# Altium schematic sheet EMGV1.SchDoc
size A1
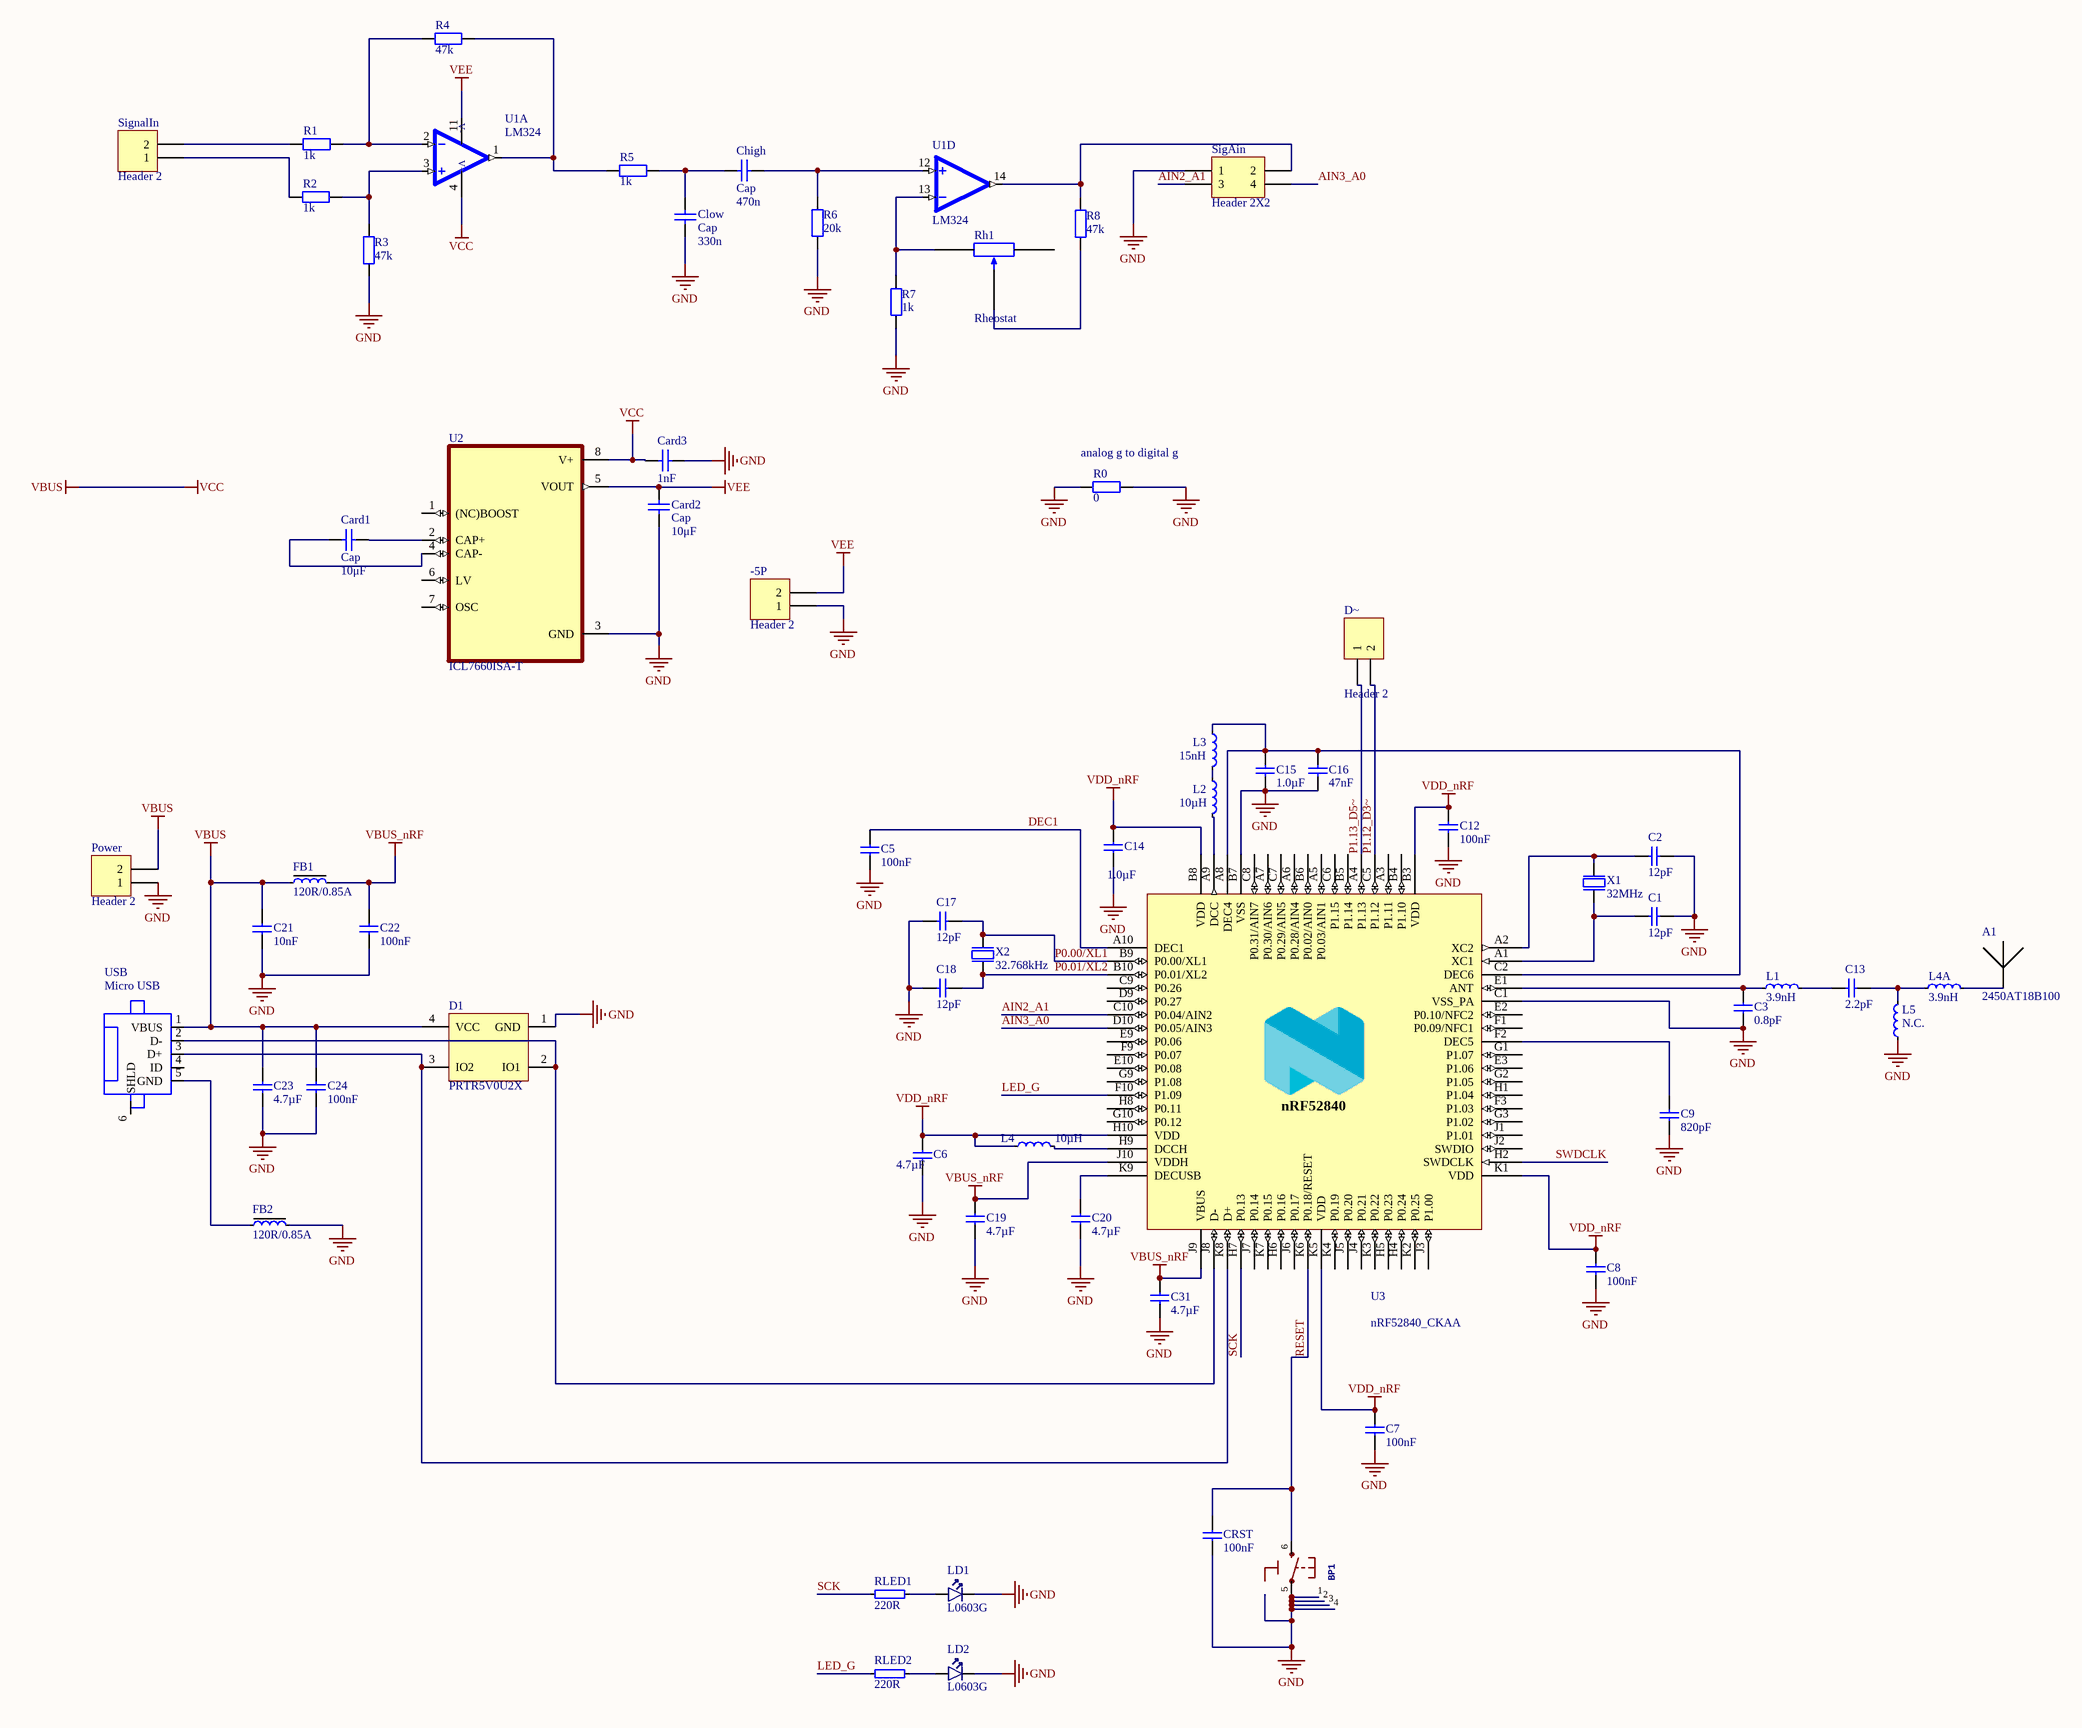
[diagram p0: EMGV1.SchDoc]

## Parts
-5P  Header 2  [HDR1X2]
A1  2450AT18B100  [2450AT18B100]
BP1  PTS820  [C&K_PTS820_NO_HOLES]  (value not drawn)
C1  12pF  [CAPC0603X03L_C]
C2  12pF  [CAPC0603X03L_C]
C3  0.8pF  [CAPC0603X03L_C]
C5  100nF  [CAPC0603X03L_C]
C6  4.7µF  [CAPC1608X06L]
C7  100nF  [CAPC0603X03L_C]
C8  100nF  [CAPC0603X03L_C]
C9  820pF  [CAPC0603X03L_C]
C12  100nF  [CAPC0603X03L_C]
C13  2.2pF  [CAPC0603X03L_C]
C14  1.0µF  [CAPC1608X06L]
C15  1.0µF  [CAPC1608X06L]
C16  47nF  [CAPC0603X03L_C]
C17  12pF  [CAPC0603X03L_C]
C18  12pF  [CAPC0603X03L_C]
C19  4.7µF  [CAPC1005X04L]
C20  4.7µF  [CAPC1608X06L]
C21  10nF  [CAPC0603X03L_C]
C22  100nF  [CAPC0603X03L_C]
C23  4.7µF  [CAPC1005X04L]
C24  100nF  [CAPC0603X03L_C]
C31  4.7µF  [CAPC1005X04L]
Card1  Cap  value 10μF  [6-0805_N]
Card2  Cap  value 10μF  [6-0805_N]
Card3  value 1nF  [LC-0603_C]  (hidden comment: Cap)
Chigh  Cap  value 470n  [LC-0603_C]
Clow  Cap  value 330n  [LC-0603_C]
CRST  100nF  [CAPC0603X03L_C]
D1  PRTR5V0U2X  [SOT190P230X110-4L]
D~  Header 2  [HDR1X2]
FB1  120R/0.85A  [INDC0603X03L_C]
FB2  120R/0.85A  [INDC0603X03L_C]
L1  3.9nH  [INDC0603X03L_C]
L2  10µH  [INDC1608X06L]
L3  15nH  [INDC1005X04L]
L4  10µH  [INDC1608X06L]
L4A  3.9nH  [INDC0603X03L_C]
L5  N.C.  [INDC0603X03L_C]
LD1  L0603G  [LED_0603_G]
LD2  L0603G  [LED_0603_G]
Power  Header 2  [HDR1X2]
R0  value 0  [RESC0603X03L_C]  (hidden comment: Res2)
R1  value 1k  [RESC0603X03L_C]  (hidden comment: Res2)
R2  value 1k  [RESC0603X03L_C]  (hidden comment: Res2)
R3  value 47k  [RESC0603X03L_C]  (hidden comment: Res2)
R4  value 47k  [RESC0603X03L_C]  (hidden comment: Res2)
R5  value 1k  [RESC0603X03L_C]  (hidden comment: Res2)
R6  value 20k  [RESC0603X03L_C]  (hidden comment: Res2)
R7  value 1k  [RESC0603X03L_C]  (hidden comment: Res2)
R8  value 47k  [RESC0603X03L_C]  (hidden comment: Res2)
Rh1  Rheostat  [Rheostat_SMD]
RLED1  220R  [RESC0603X03L_C]
RLED2  220R  [RESC0603X03L_C]
SigAin  Header 2X2  [HDR2X2]
SignalIn  Header 2  [HDR1X2]
U1  LM324  [SOIC127P600X175-14N]  (parts A,D of 4)
U2  ICL7660ISA-T  [SOIC127P600X175-8N]
U3  nRF52840_CKAA  [BGA94C35P10X10_352X356X50]
USB  Micro USB  [1981584-1]
X1  32MHz  [BT-XTAL_2016]
X2  32.768kHz  [XTAL_2012]

## Nets
GND: -5P.1 BP1.1 BP1.2 BP1.3 BP1.4 BP1.5 C1.2 C2.2 C3.1 C5.2 C6.2 C7.2 C8.2 C9.2 C12.2 C14.2 C15.1 C16.2 C17.2 C18.2 C19.2 C20.2 C21.1 C22.1 C23.1 C24.1 C31.2 Card2.1 Card3.2 Clow.1 CRST.2 D1.1(GND) FB2.2 L5.1 LD1.1(C) LD2.1(C) Power.1 R0.1 R0.2 R3.1 R6.1 R7.2 SigAin.1 U2.3(GND) U3.B7(VSS) U3.C1(VSS_PA) U3.C4(GND) U3.D3(GND) U3.D4(GND) U3.D5(GND) U3.D6(GND) U3.D7(GND) U3.D8(GND) U3.E4(GND) U3.E5(GND) U3.E6(GND) U3.E7(GND) U3.E8(GND) U3.F4(GND) U3.F5(GND) U3.F6(GND) U3.F7(GND) U3.F8(GND) U3.G4(GND) U3.G5(GND) U3.G6(GND) U3.G7(GND) U3.G8(GND) U3.K10(GND) X1.2(GND) X1.4(GND)
VBUS: C21.2 C23.2 C24.2 Card3.1 D1.4(VCC) FB1.1 Power.2 U1.4(VCC+) U2.8(V+) USB.1(VBUS)  [also labelled VCC]
VBUS_nRF: C19.1 C22.2 C31.1 FB1.2 U3.J9(VBUS) U3.J10(VDDH)
VDD_nRF: C6.1 C7.1 C8.1 C12.1 C14.1 L4.1 U3.B3(VDD) U3.B8(VDD) U3.H10(VDD) U3.K1(VDD) U3.K5(VDD)
VEE: -5P.2 Card2.2 U1.11(VCC-) U2.5(VOUT)
AIN2_A1: SigAin.3 U3.C10(P0.04/AIN2)
AIN3_A0: SigAin.4 U3.D10(P0.05/AIN3)
DEC1: C5.1 U3.A10(DEC1)
LED_G: RLED2.2 U3.F10(P1.09)
P0.00/XL1: C17.1 U3.B9(P0.00/XL1) X2.1(inp)
P0.01/XL2: C18.1 U3.B10(P0.01/XL2) X2.2(out)
P1.12_D3~: D~.2 U3.C5(P1.12)
P1.13_D5~: D~.1 U3.A4(P1.13)
RESET: BP1.6 CRST.1 U3.K6(P0.18/RESET)
SCK: RLED1.2 U3.H7(P0.13)
SWDCLK: U3.H2(SWDCLK)
NetA1_1: A1.1 L4A.2
NetC1_1: C1.1 U3.A1(XC1) X1.1(inp)
NetC2_1: C2.1 U3.A2(XC2) X1.3(out)
NetC3_2: C3.2 L1.1 U3.E1(ANT)
NetC9_1: C9.1 U3.F2(DEC5)
NetC13_1: C13.1 L4A.1 L5.2
NetC13_2: C13.2 L1.2
NetC15_2: C15.2 C16.1 L3.1 U3.A8(DEC4) U3.C2(DEC6)
NetC20_1: C20.1 U3.K9(DECUSB)
NetCard1_1: Card1.1 U2.4(CAP-)
NetCard1_2: Card1.2 U2.2(CAP+)
NetChigh_1: Chigh.1 Clow.2 R5.1
NetChigh_2: Chigh.2 R6.2 U1.12(NON-INVERTING_INPUT4)
NetD1_2: D1.2(IO1) U3.J8(D-) USB.2(D-)
NetD1_3: D1.3(IO2) U3.K8(D+) USB.3(D+)
NetFB2_1: FB2.1 USB.5(GND)
NetL2_1: L2.1 L3.2
NetL2_2: L2.2 U3.A9(DCC)
NetL4_2: L4.2 U3.H9(DCCH)
NetLD1_2: LD1.2(A) RLED1.1
NetLD2_2: LD2.2(A) RLED2.1
NetR1_1: R1.1 SignalIn.2
NetR1_2: R1.2 R4.1 U1.2(INVERTING_INPUT1)
NetR2_1: R2.1 SignalIn.1
NetR2_2: R2.2 R3.2 U1.3(NON-INVERTING_INPUT1)
NetR4_2: R4.2 R5.2 U1.1(OUTPUT1)
NetR7_1: R7.1 Rh1.1 U1.13(INVERTING_INPUT4)
NetR8_1: R8.1 SigAin.2 U1.14(OUTPUT4)
NetR8_2: R8.2 Rh1.2

Not connected (* = marked no-connect by the designer): Rh1 3; U2 1((NC)BOOST) 6(LV) 7(OSC); U3 A3(P1.11) A5(P0.03/AIN1) A6(P0.28/AIN4) A7(P0.30/AIN6) B4(P1.10) B5(P1.14) B6(P0.02/AIN0) C6(P1.15) C7(P0.29/AIN5) C8(P0.31/AIN7) C9(P0.26) D9(P0.27) E2(P0.10/NFC2) E3(P1.06) E9(P0.06) E10(P0.08) F1(P0.09/NFC1) F3(P1.03) F9(P0.07) G1(P1.07) G2(P1.05) G3(P1.02) G9(P1.08) G10(P0.12) H1(P1.04) H4(P0.24) H5(P0.23) H6(P0.16) H8(P0.11) J1(P1.01) J2(SWDIO) J3(P1.00) J4(P0.21) J5(P0.20) J6(P0.17) J7(P0.14) K2(P0.25) K3(P0.22) K4(P0.19) K7(P0.15); USB 4(ID) 6(SHLD)

## Notes on the sheet
- (near R0) analog g to digital g
- (in symbol LM324, part A) V-; V+
- (in symbol nRF52840_CKAA) nRF52840

## Library data of the parts
-5P D~ Power SignalIn = Header 2: Header, 2-Pin; LatestRevisionDate: 17-Jul-2002; LatestRevisionNote: Re-released for DXP Platform.; Publisher: Altium Limited
A1 = Antenna: 2.45 GHz chip antenna; Part Number: Johanson 2450AT18B100; Manufacturer: Johanson Technology; Part number IPS: 00000007781; Artikkelnr Noca: N.A.; Manufacturer Part Number: 2450AT18B100; Datasheet: http://www.johansontechnology.com/datasheets/antennas/2450AT18B100.pdf; Footprint Doc: 2450AT18B100; LatestRevisionDate: 2013-09-13; Pin Count: 2; Publisher: Nordic Semiconductor; Published: 2013-09-13; Value: 2450AT18B100; Note: *; Supplier: Digi-Key; Supplier part number: 712-1006-1-ND; 2nd source Supplier: *; 2nd source part number: *; Artikkelnr Simpro: N.A.
BP1 = TACTILE1PTS820-NH: Tactile Switch SPST-NO Top Actuated Surface Mount; MANUFACTURER: C&K; MANUFACTURER-PN: PTS820 J25K SMTR LFS; GateName_1: G$1; SymbolName_1: TACTILE-3PINS; CODE-ARDUINO: 0173; DeviceName: PTS820-NH; LibraryName: Arduino-pushbuttons; DeviceSetName: TACTILE1; DATASHEET: http://www.ckswitches.com/media/1474/pts820.pdf; DISTRIBUTOR-LINK: https://www.digikey.com/product-detail/en/c-k/PTS820-J15M-SMTR-LFS/CKN10506CT-ND/4176681; DISTRIBUTOR-PN: PTS820 J25K SMTR LFS-ND
C1 C2 C17 C18 = C0201-12p: Capacitor, NP0, ±2%; Part number IPS: 00000007848; Note: 25V; Artikkelnr Noca: N.A.; Part Number: C0201-12p; Manufacturer: *; Manufacturer Part Number: *; LatestRevisionDate: 2017-11-09; Pin Count: 2; Publisher: Nordic Semiconductor; Published: 2014-11-13; Value: 12pF; Supplier: *; Supplier part number: *; 2nd source Supplier: *; 2nd source part number: *; Footprint Doc: 0201; Artikkelnr Simpro: N.A.; ComponentLink1Description: Datasheet; ComponentLink1URL: *; ComponentLink2Description: Supplier link; ComponentLink2URL: *; HelpURL: *
C3 C13 = C0201-1.0p: Capacitor, NP0, ±5%; Value: 1.0pF; Part Number: C0201-1.0p; Manufacturer: *; Manufacturer Part Number: *; LatestRevisionDate: 2018-10-22; Pin Count: 2; Publisher: Nordic Semiconductor; Published: 2014-11-13; Footprint Doc: 0201
C5 C7 C8 C12 C22 C24 CRST = C0201-100n: Capacitor, X5R, ±10%; Part number IPS: 00000001248; Note: 16V; Artikkelnr Noca: N.A.; Part Number: C0201-100n; Manufacturer: *; Manufacturer Part Number: *; LatestRevisionDate: 2017-11-09; Pin Count: 2; Publisher: Nordic Semiconductor; Published: 2014-11-13; Value: 100nF; Supplier: *; Supplier part number: *; 2nd source Supplier: *; 2nd source part number: *; Footprint Doc: 0201; Artikkelnr Simpro: N.A.; ComponentLink1Description: Datasheet; ComponentLink1URL: *; ComponentLink2Description: Supplier link; ComponentLink2URL: *; HelpURL: *
C6 C20 C31 = C0603-4µ7: Capacitor, X5R, ±10%; Part number IPS: 00000007783; Note: 6.3V; Artikkelnr Noca: 20069060; Artikkelnr Simpro: N.A.; Part Number: C0603-4µ7; Manufacturer: *; Manufacturer Part Number: *; LatestRevisionDate: 2009-11-23; Pin Count: 2; Publisher: Nordic Semiconductor; Published: 2009-05-08; Value: 4.7µF; Supplier: *; Supplier part number: *; 2nd source Supplier: *; 2nd source part number: *; Footprint Doc: 0603; ComponentLink1Description: Datasheet; ComponentLink1URL: *; ComponentLink2Description: Supplier link; ComponentLink2URL: *; HelpURL: *
C9 = C0201-820p: Capacitor, X7R, ±10%; Part number IPS: 00000001249; Note: 25V; Artikkelnr Noca: N.A.; Part Number: C0201-820p; Manufacturer: *; Manufacturer Part Number: *; LatestRevisionDate: 2017-11-09; Pin Count: 2; Publisher: Nordic Semiconductor; Published: 2014-11-13; Value: 820pF; Supplier: *; Supplier part number: *; 2nd source Supplier: *; 2nd source part number: *; Footprint Doc: 0201; Artikkelnr Simpro: N.A.; ComponentLink1Description: Datasheet; ComponentLink1URL: *; ComponentLink2Description: Supplier link; ComponentLink2URL: *; HelpURL: *
C14 C15 = C0603-1µ0: Capacitor, X7R, ±10%; Part number IPS: 00000000616; Note: 16V; Artikkelnr Noca: 20039335; Artikkelnr Simpro: N.A.; Part Number: C0603-1µ0; Manufacturer: *; Manufacturer Part Number: *; LatestRevisionDate: 2013-06-05; Pin Count: 2; Publisher: Nordic Semiconductor; Published: 2009-05-08; Value: 1.0µF; Supplier: *; Supplier part number: *; 2nd source Supplier: *; 2nd source part number: *; Footprint Doc: 0603; ComponentLink1Description: Datasheet; ComponentLink1URL: *; ComponentLink2Description: Supplier link; ComponentLink2URL: *; HelpURL: *
C16 = C0201-47n: Capacitor, X5R, ±10%; Part number IPS: 00000001250; Note: 10V; Artikkelnr Noca: N.A.; Part Number: C0201-47n; LatestRevisionDate: 2017-11-09; Pin Count: 2; Publisher: Nordic Semiconductor; Published: 2014-11-13; Value: 47nF; Footprint Doc: 0201; Manufacturer: *; Manufacturer Part Number: *; Supplier: *; Supplier part number: *; 2nd source Supplier: *; 2nd source part number: *; Artikkelnr Simpro: N.A.; ComponentLink1Description: Datasheet; ComponentLink1URL: *; ComponentLink2Description: Supplier link; ComponentLink2URL: *; HelpURL: *
C19 C23 = C0402-4µ7: Capacitor, X5R, ±20%; Part number IPS: 00000001251; Note: 10V; Artikkelnr Noca: 20039482; Artikkelnr Simpro: N.A.; Part Number: C0402-4µ7; Manufacturer: *; Manufacturer Part Number: *; LatestRevisionDate: 2017-11-09; Pin Count: 2; Publisher: Nordic Semiconductor; Published: 2009-05-08; Value: 4.7µF; Supplier: Digi-Key; Supplier part number: 490-13252-1-ND; 2nd source Supplier: *; 2nd source part number: *; Footprint Doc: 0402; ComponentLink1Description: Datasheet; ComponentLink1URL: *; ComponentLink2Description: Supplier link; ComponentLink2URL: *; HelpURL: *
C21 = C0201-10n: Capacitor, X7R, ±10%; Part number IPS: 00000003480; Note: 10V; Artikkelnr Noca: N.A.; Part Number: C0201-10n; Manufacturer: *; Manufacturer Part Number: *; LatestRevisionDate: 2017-11-09; Pin Count: 2; Publisher: Nordic Semiconductor; Published: 2014-11-13; Value: 10nF; Supplier: *; Supplier part number: *; 2nd source Supplier: *; 2nd source part number: *; Footprint Doc: 0201; Artikkelnr Simpro: N.A.; ComponentLink1Description: Datasheet; ComponentLink1URL: *; ComponentLink2Description: Supplier link; ComponentLink2URL: *; HelpURL: *
Card1 Card2 = Cap_8: Capacitor; Published: 8-Jun-2000; LatestRevisionDate: 17-Jul-2002; LatestRevisionNote: Re-released for DXP Platform.; PackageReference: RAD-0.3; Publisher: Altium Limited; PackageDescription: Radial Cap, Thru-Hole; 2 Leads; 0.3 in Pin Spacing
Card3 = Cap_1: Capacitor; Published: 8-Jun-2000; LatestRevisionDate: 17-Jul-2002; LatestRevisionNote: Re-released for DXP Platform.; PackageReference: RAD-0.3; Publisher: Altium Limited; PackageDescription: Radial Cap, Thru-Hole; 2 Leads; 0.3 in Pin Spacing
Chigh Clow = Cap: Capacitor; Published: 8-Jun-2000; LatestRevisionDate: 17-Jul-2002; LatestRevisionNote: Re-released for DXP Platform.; PackageReference: RAD-0.3; Publisher: Altium Limited; PackageDescription: Radial Cap, Thru-Hole; 2 Leads; 0.3 in Pin Spacing
D1 = PRTR5V0U2X: Ultra low capacitance double rail-to-rail ESD protection diode; Manufacturer: NXP; 2nd source part number: 152-4157; Part number IPS: 00000009951; Artikkelnr Noca: 10069015; Artikkelnr Simpro: N.A.; Part Number: PRTR5V0U2X; Manufacturer Part Number: PRTR5V0U2X; LatestRevisionDate: 2017-11-09; Publisher: Nordic Semiconductor; Published: 2012-06-11; Value: PRTR5V0U2X; Note: *; Supplier: Digi-Key; Supplier part number: 568-4140-1-ND; 2nd source Supplier: Farnell; Footprint Doc: SOT-143B; ComponentLink1Description: Datasheet; ComponentLink1URL: *; ComponentLink2Description: Supplier link; ComponentLink2URL: *; HelpURL: http://www.farnell.com/datasheets/109718.pdf; Pin Count: 4
FB1 FB2 = FB0201-120R@100M-850mA: Ferrite Bead, 120 Ohm @ 100MHz, 850mA, 150 mOhm Max; Manufacturer: Taiyo Yuden; Manufacturer Part Number: BKP0603HS121-T; Part number IPS: 00000001252; Note: Chip EMIFIL Inductor Type Chip Ferrite Bead; Artikkelnr Noca: N.A.; Part Number: FB0201-120R@100M-850mA; Footprint Doc: 0402; LatestRevisionDate: 2016-08-23; Pin Count: 2; Publisher: Nordic Semiconductor; Published: 2016-08-23; Value: 120R/0.85A; Supplier: Digi-Key; Supplier part number: 587-3286-1-ND; 2nd source Supplier: *; 2nd source part number: *; Artikkelnr Simpro: N.A.; ComponentLink1Description: Datasheet; ComponentLink1URL: *; ComponentLink2Description: Supplier link; HelpURL: http://ds.yuden.co.jp/TYCOMPAS/ut/detail.do?productNo=BKP0603HS121-T&fileName=BKP0603HS121-T_SS&mode=specSheetDownload
L1 L4A = L0201-3n9: High frequency chip inductor ±5%; Part Number: L0201-3n9; Manufacturer: *; Manufacturer Part Number: *; LatestRevisionDate: 2017-11-09; Pin Count: 2; Publisher: Nordic Semiconductor; Published: 2013-04-10; Value: 3.9nH; Footprint Doc: 0201
L2 L4 = L0603-10µ: Inductor, 80mA, ±10%; Manufacturer: Taiyo Yuden; Manufacturer Part Number: LBMF1608T100K; 2nd source part number: 178-6105; Part number IPS: 00000007794; Note: LBMF1608T100K 10µH 80mA 0603; Artikkelnr Noca: 33029314; Artikkelnr Simpro: N.A.; Part Number: L0603-10µ; LatestRevisionDate: 2012-09-19; Pin Count: 2; Publisher: Nordic Semiconductor; Published: 2010-02-24; Value: 10µH; Supplier: Digi-Key; Supplier part number: 587-1714-1-ND; 2nd source Supplier: Farnell; Footprint Doc: 0603; ComponentLink1Description: Datasheet; ComponentLink1URL: *; ComponentLink2Description: Supplier link; HelpURL: http://www.yuden.co.jp/ut/product/pdf/elb2_e.pdf
L3 = L0402-15n: Inductor, 320mA, ±5%; Manufacturer: Taiyo Yuden; Manufacturer Part Number: HK100515NJ-T; 2nd source part number: 658-1328; Part number IPS: 00000001262; Note: High frequency chip inductor ±10%; Artikkelnr Noca: 33029323; Artikkelnr Simpro: N.A.; Part Number: L0402-15n; LatestRevisionDate: 2012-09-19; Pin Count: 2; Publisher: Nordic Semiconductor; Published: 2010-07-12; Value: 15nH; Supplier: Digi-Key; Supplier part number: 587-1521-1-ND; 2nd source Supplier: Farnell; Footprint Doc: 0402; ComponentLink1Description: Datasheet; ComponentLink1URL: *; ComponentLink2Description: Supplier link; HelpURL: http://www.yuden.co.jp/productdata/catalog/en/mlci04_e.pdf
L5 = L0201-3n9: High frequency chip inductor ±5%; Value: 3.9nH; Part Number: L0201-3n9; Manufacturer: *; Manufacturer Part Number: *; LatestRevisionDate: 2017-11-09; Pin Count: 2; Publisher: Nordic Semiconductor; Published: 2013-04-10; Footprint Doc: 0201
LD1 LD2 = VS 25C7M5: LED, Green, 0603, 573nm, Vf=2.0V, 24mcd, - 40 to +85°C; Manufacturer: Victory Electronics; Artikkelnr Noca: N.A.; Part Number: VS 25C7M5; Manufacturer Part Number: VS 25C7M5; LatestRevisionDate: 2017-08-21; Pin Count: 2; Publisher: Nordic Semiconductor; Published: 2017-08-21; Value: L0603G; Note: *; Supplier: EC Partner; Supplier part number: *; 2nd source Supplier: *; 2nd source part number: *; Footprint Doc: 0603; Artikkelnr Simpro: N.A.; ComponentLink1Description: Datasheet; ComponentLink1URL: *; ComponentLink2Description: Supplier link; ComponentLink2URL: *; HelpURL: \\hizz\pro\app9717\Datasheet\optoelectronics\Victory Electronics\VS 25C7M5.pdf
R0-R8 = Res2_5: Resistor; Published: 8-Jun-2000; LatestRevisionDate: 17-Jul-2002; LatestRevisionNote: Re-released for DXP Platform.; PackageReference: AXIAL-0.4; Publisher: Altium Limited; PackageDescription: Axial Device, Thru-Hole; 2 Leads; 0.4 in Pin Spacing
RLED1 RLED2 = R0201-220: Resistor, ±1%, 0.05W; Part number IPS: 00000000863; Note: Chip Res 1%; Artikkelnr Noca: N.A.; Value Ohm: 220; Part Number: R0201-220; Manufacturer: *; Manufacturer Part Number: *; LatestRevisionDate: 2014-11-13; Pin Count: 2; Publisher: Nordic Semiconductor; Published: 2014-11-13; Value: 220R; Supplier: *; Supplier part number: *; 2nd source Supplier: *; 2nd source part number: *; Footprint Doc: 0201; Artikkelnr Simpro: N.A.; ComponentLink1Description: Datasheet; ComponentLink1URL: *; ComponentLink2Description: Supplier link; ComponentLink2URL: *; HelpURL: *
SigAin = Header 2X2: Header, 2-Pin, Dual row; LatestRevisionDate: 17-Jul-2002; LatestRevisionNote: Re-released for DXP Platform.; Publisher: Altium Limited
U1 = LM324: General Purpose Amplifier 4 Circuit 14-SOIC; MF: Texas Instruments; Price: None; MP: LM324; Package: SOIC-14 Texas Instruments; Value: *; Availability: Unavailable; SnapEDA_Link: https://www.snapeda.com/parts/LM324/Texas%20Instruments/view-part/2758578/?ref=snap
U2 = ICL7660ISA-T: Switching Voltage Regulators Switched-Capacitor Voltage Converter; MF: Maxim Integrated; MP: ICL7660ISA-T; Availability: Unavailable; SnapEDA_Link: https://www.snapeda.com/parts/ICL7660ISA-T/Maxim%20Integrated/view-part/975477/?ref=snap; Package: None; Price: None; Value: *
U3 = nRF52840_CKAA: Multi-protocol Bluetooth Low Energy, IEEE 802.15.4, ANT and 2.4GHz proprietary system-on-chip; Part Number: nRF52840-CKAAD0; Manufacturer: Nordic Semiconductor; LatestRevisionDate: 2018-12-17; Pin Count: 94; Publisher: Nordic Semiconductor; Published: 2018-12-17; Value: nRF52840_CKAA; Footprint Doc: WLCSP-94; Manufacturer Part Number: nRF52840-CKAAD0
USB = 1981584-1: CONN RCPT MICRO USB TYPE AB; Manufacturer: REG CON; PartNumber: C21377; Vendor: LCSC; Value: Micro USB
X1 = XTAL_SMD2016_32MHz_8pF_Murata: XTAL SMD 2016, 32MHz, Cl=8pF, Tol: ±10ppm, Stab: ±10ppm; Manufacturer: Murata; Manufacturer Part Number: XRCGB32M000F1H01R0; Part number IPS: 80000001424; Note: XTAL SMD 32.000MHz; Artikkelnr Noca: N.A.; Part Number: XTAL_SMD2016_32MHz_8pF_Murata; LatestRevisionDate: 2017-11-09; Pin Count: 4; Publisher: Nordic Semiconductor; Published: 2016-10-26; Value: 32MHz; Supplier: *; Supplier part number: *; 2nd source Supplier: *; 2nd source part number: *; Footprint Doc: XTAL_2016; Artikkelnr Simpro: N.A.; ComponentLink1Description: Datasheet; ComponentLink1URL: *; ComponentLink2Description: Supplier link; ComponentLink2URL: *; HelpURL: http://www.murata.com/en-global/products/productdetail.aspx?cate=cgsubCrystalUnits&partno=XRCGB32M000F1H01R0
X2 = XTAL_SMD2012_32.768kHz_9pF_Seiko: XTAL SMD 2012, 32.768kHz, 9pF, ±20ppm; Manufacturer: Seiko; Manufacturer Part Number: SC20S-9.0PF20PPM; Part number IPS: 80000001425; Note: XTAL SMD 32.768kHz; Artikkelnr Noca: N.A.; Part Number: XTAL_SMD2012_32.768kHz_9pF_Seiko; LatestRevisionDate: 2017-11-09; Pin Count: 2; Publisher: Nordic Semiconductor; Published: 2015-10-15; Value: 32.768kHz; Supplier: *; Supplier part number: *; 2nd source Supplier: *; 2nd source part number: *; Footprint Doc: XTAL_2012; Artikkelnr Simpro: N.A.; ComponentLink1Description: Datasheet; ComponentLink1URL: *; ComponentLink2Description: Supplier link; ComponentLink2URL: *; HelpURL: http://www.sii.co.jp/en/quartz/files/2013/03/file_PRODUCT_MASTER_50811_GRAPHIC03.pdf